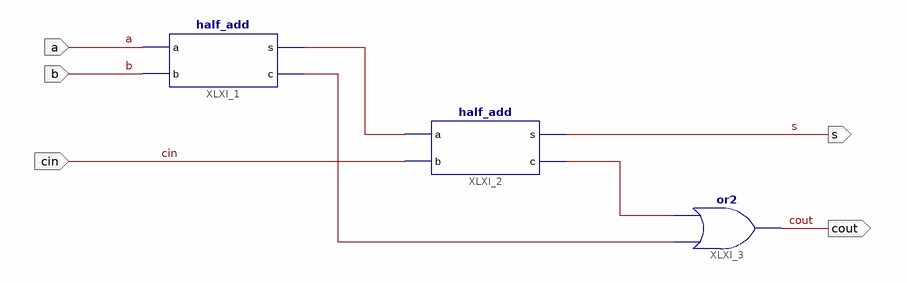
[diagram p0: schematic sheet 1]
// Xilinx ISE schematic add1bit.sch (spartan3e) as structural Verilog: 3 symbols, 5 ports
module add1bit (
  input  a,
  input  cin,
  input  b,
  output cout,
  output s
);

  wire XLXN_1, XLXN_5, XLXN_6;

  half_add XLXI_1 (.a(a), .b(b), .s(XLXN_1), .c(XLXN_6));
  half_add XLXI_2 (.a(XLXN_1), .b(cin), .s(s), .c(XLXN_5));
  or XLXI_3 (cout, XLXN_6, XLXN_5);
endmodule
